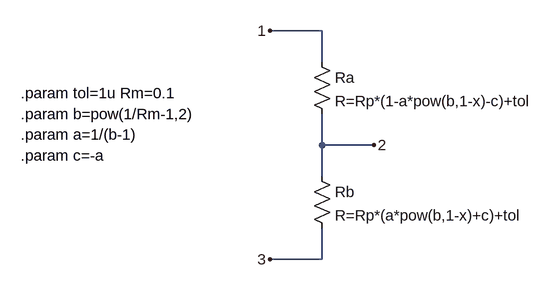
[diagram p0: schematic InverseLogarithmicPotentiometer.asc]
InverseLogarithmicPotentiometer.asc, the LTspice schematic file:
Version 4
SHEET 1 880 680
WIRE 208 0 128 0
WIRE 208 48 208 0
WIRE 208 176 208 128
WIRE 288 176 208 176
WIRE 208 224 208 176
WIRE 208 352 208 304
WIRE 208 352 128 352
FLAG 128 0 1
FLAG 128 352 3
FLAG 288 176 2
SYMBOL res 192 32 R0
SYMATTR InstName Ra
SYMATTR Value R=Rp*(1-a*pow(b,1-x)-c)+tol
SYMBOL res 192 208 R0
SYMATTR InstName Rb
SYMATTR Value R=Rp*(a*pow(b,1-x)+c)+tol
TEXT -256 96 Left 2 !.param tol=1u Rm=0.1
TEXT -256 128 Left 2 !.param b=pow(1/Rm-1,2)
TEXT -256 160 Left 2 !.param a=1/(b-1)
TEXT -256 192 Left 2 !.param c=-a

The netlist it stands for:
* InverseLogarithmicPotentiometer.asc
Ra 1 2 R=Rp*(1-a*pow(b,1-x)-c)+tol
Rb 2 3 R=Rp*(a*pow(b,1-x)+c)+tol
.param tol=1u Rm=0.1
.param b=pow(1/Rm-1,2)
.param a=1/(b-1)
.param c=-a
.backanno
.end